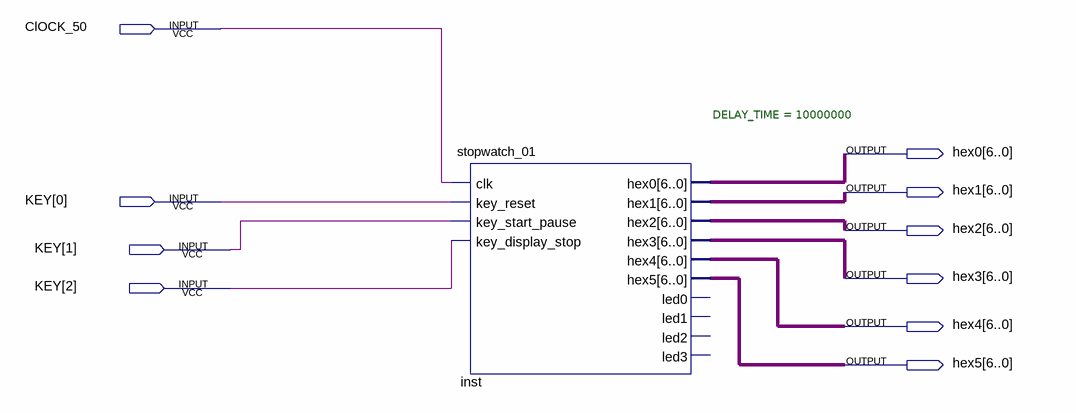
[diagram p0: schematic sheet]
// Quartus schematic project1_counter.bdf as structural Verilog: 1 symbols, 10 pins
module project1_counter (
  input  ClOCK_50,
  input  [2:0] KEY,
  output [6:0] hex0,
  output [6:0] hex1,
  output [6:0] hex2,
  output [6:0] hex3,
  output [6:0] hex4,
  output [6:0] hex5
);

  stopwatch_01 #(.DELAY_TIME(10000000)) inst (
    .clk(ClOCK_50), .key_reset(KEY[0]), .key_start_pause(KEY[1]), .key_display_stop(KEY[2]), .hex0(hex0),
    .hex1(hex1), .hex2(hex2), .hex3(hex3), .hex4(hex4), .hex5(hex5));  // open: led0, led1, led2, led3
endmodule
